# EAGLE design AmplifierHardwareSupply (EAGLE 9.5.2)
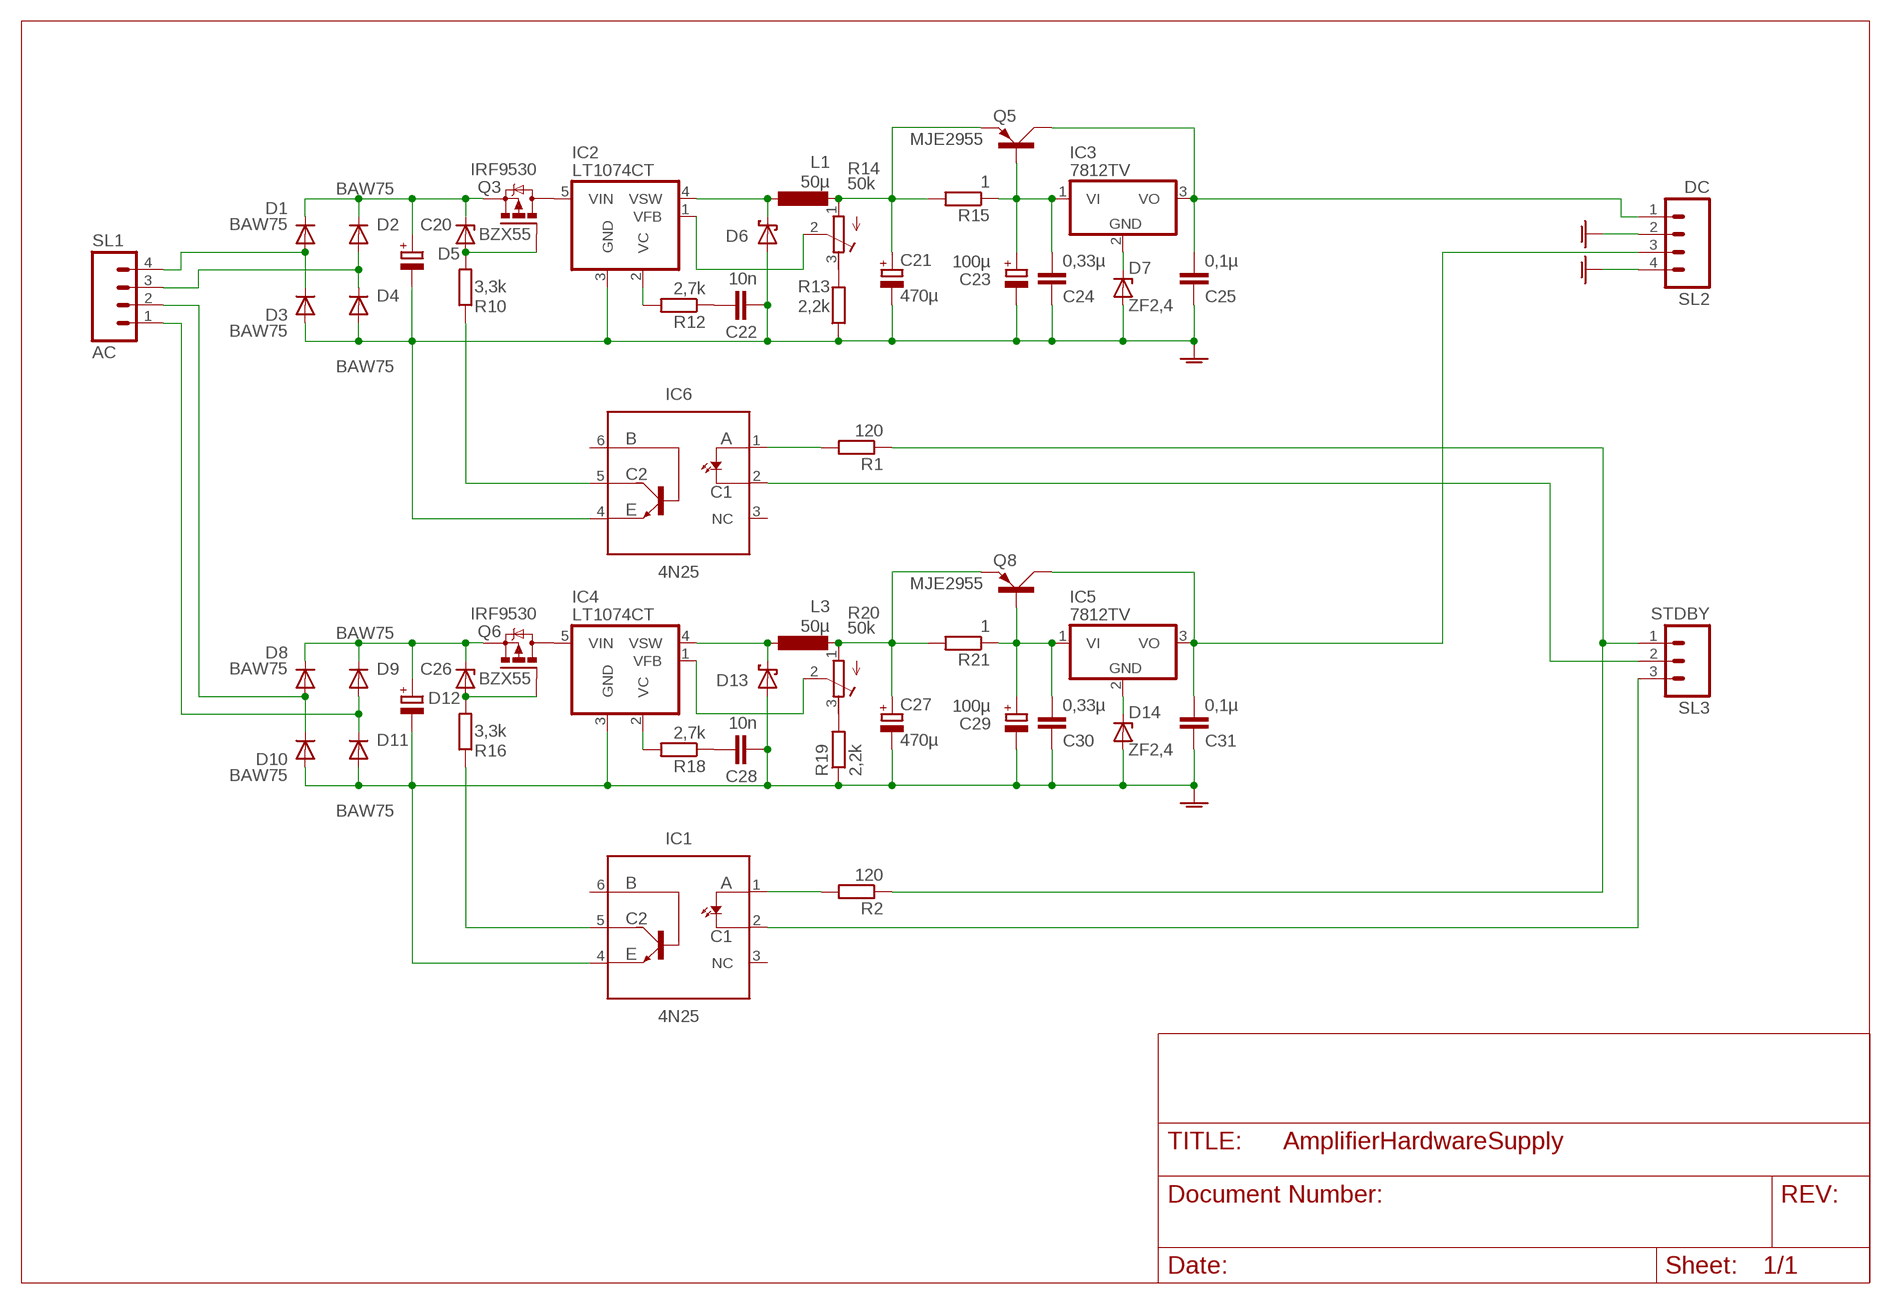
[diagram p0: schematic, sheet 1]

## Parts
C20  CPOL-EUE5-10.5  [E5-10,5]
C21  470µ  CPOL-EUE5-10.5  [E5-10,5]
C22  10n  C-EU025-024X044  [C025-024X044]
C23  100µ  CPOL-EUE5-10.5  [E5-10,5]
C24  0,33µ  C-EU025-024X044  [C025-024X044]
C25  0,1µ  C-EU025-024X044  [C025-024X044]
C26  CPOL-EUE5-10.5  [E5-10,5]
C27  470µ  CPOL-EUE5-10.5  [E5-10,5]
C28  10n  C-EU025-024X044  [C025-024X044]
C29  100µ  CPOL-EUE5-10.5  [E5-10,5]
C30  0,33µ  C-EU025-024X044  [C025-024X044]
C31  0,1µ  C-EU025-024X044  [C025-024X044]
D1  BAW75  [DO35-10]
D2  BAW75  [DO35-10]
D3  BAW75  [DO35-10]
D4  BAW75  [DO35-10]
D5  BZX55  [DO35Z10]
D6  SCHOTTKY-DIODEDO35-7  [DO35-7]
D7  ZF2,4  BZV10  [DO34Z7]
D8  BAW75  [DO35-10]
D9  BAW75  [DO35-10]
D10  BAW75  [DO35-10]
D11  BAW75  [DO35-10]
D12  BZX55  [DO35Z10]
D13  SCHOTTKY-DIODEDO35-7  [DO35-7]
D14  ZF2,4  BZV10  [DO34Z7]
IC1  4N25  [DIP762W60P254L712H480Q6B]
IC2  LT1074CT  [TO220-5]
IC3  7812TV  [TO220V]
IC4  LT1074CT  [TO220-5]
IC5  7812TV  [TO220V]
IC6  4N25  [DIP762W60P254L712H480Q6B]
L1  50µ  L-EUTJ3-U1  [TJ3-U1]
L3  50µ  L-EUTJ3-U1  [TJ3-U1]
Q3  IRF9530  [TO220BV]
Q5  MJE2955  [TO220AV]
Q6  IRF9530  [TO220BV]
Q8  MJE2955  [TO220AV]
R1  120  R-EU_0207/2V  [0207/2V]
R2  120  R-EU_0207/2V  [0207/2V]
R10  3,3k  R-EU_0207/2V  [0207/2V]
R12  2,7k  R-EU_0207/2V  [0207/2V]
R13  2,2k  R-EU_0207/2V  [0207/2V]
R14  50k  R-TRIMM64W  [RTRIM64W]
R15  1  R-EU_0207/2V  [0207/2V]
R16  3,3k  R-EU_0207/2V  [0207/2V]
R18  2,7k  R-EU_0207/2V  [0207/2V]
R19  2,2k  R-EU_0207/2V  [0207/2V]
R20  50k  R-TRIMM64W  [RTRIM64W]
R21  1  R-EU_0207/2V  [0207/2V]
SL1  AC  M04  [04P]
SL2  DC  M04  [04P]
SL3  STDBY  M03  [03P]

## Nets
+UB2: C31.2 IC5.3(VO) Q8.C SL2.3
AGND: C20.- C21.- C22.2 C23.- C24.1 C25.1 C26.- C27.- C28.2 C29.- C30.1 C31.1 D3.A D4.A D6.A D7.A D10.A D11.A D13.A D14.A IC1.4(E) IC2.3(GND) IC4.3(GND) IC6.4(E) R13.1 R19.1 SL2.2 SL2.4
N$1: C25.2 IC3.3(VO) Q5.C SL2.1
N$2: R1.1 R2.1 SL3.1
N$3: IC6.1(A) R1.2
N$4: IC1.1(A) R2.2
N$5: IC6.2(C1) SL3.2
N$6: IC1.2(C1) SL3.3
N$24: IC2.2(VC) R12.2
N$25: R13.2 R14.3(A)
N$26: D1.A D3.C SL1.4
N$28: IC4.2(VC) R18.2
N$30: IC2.5(VIN) Q3.D
N$31: D5.A Q3.G R10.2
N$32: IC6.5(C2) R10.1
N$33: C21.+ L1.2 Q5.E R14.1(E) R15.2
N$34: C22.1 R12.1
N$35: D6.C IC2.4(VSW) L1.1
N$36: IC2.1(VFB) R14.2(S)
N$38: D7.C IC3.2(GND)
N$39: R19.2 R20.3(A)
N$40: C23.+ C24.2 IC3.1(VI) Q5.B R15.1
N$41: D8.A D10.C SL1.2
N$43: D9.A D11.C SL1.1
N$44: C26.+ D8.C D9.C D12.C Q6.S
N$45: D12.A Q6.G R16.2
N$46: IC1.5(C2) R16.1
N$47: C28.1 R18.1
N$48: D13.C IC4.4(VSW) L3.1
N$49: IC4.5(VIN) Q6.D
N$50: C27.+ L3.2 Q8.E R20.1(E) R21.2
N$51: IC4.1(VFB) R20.2(S)
N$53: C29.+ C30.2 IC5.1(VI) Q8.B R21.1
N$55: D14.C IC5.2(GND)
N$58: C20.+ D1.C D2.C D5.C Q3.S
N$71: D2.A D4.C SL1.3
Unconnected: IC1.3(NC) IC1.6(B) IC6.3(NC) IC6.6(B)

## Library data of the parts
C20 C21 C23 C26 C27 C29 = rcl:CPOL-EU: POLARIZED CAPACITOR, European symbol
C22 C24 C25 C28 C30 C31 = rcl:C-EU: CAPACITOR, European symbol
D1-D4 D8-D11 = diode:BAW75: DIODE silicon-epitaxial planar diode
D5 D12 = diode:BZX55: Z DIODE
D6 D13 = diode:SCHOTTKY-DIODE: Schottky Diode
D7 D14 = diode:BZV10: Z DIODE
IC1 IC6 = Opto-Electronic:4N: Optocoupler, Phototransistor Output, with Base Connection Datasheet <https://www.vishay.com/docs/83725/4n25.pdf>; CATEGORY: Opto-Electronic; DESCRIPTION: Optoisolator Transistor with Base Output 5000Vrms Channel 6-DIP; MANUFACTURER: Vishay; MPN: 4N25; OPERATING_TEMP: - 55°C to + 100 °C; PART_STATUS: Active; ROHS_COMPLIANT: COMPLIANT; SERIES: 4N2x; SUB-CATEGORY: Optocoupler; THERMALLOSS: 0.150 W
IC2 IC4 = linear-technology-3:LT1074*: Step-Down Switching Regulator
IC3 IC5 = linear:78*: Positive VOLTAGE REGULATOR Source: http://cache.national.com/ds/LM/LM78L05.pdf http://www.fairchildsemi.com/ds/LM/LM7805.pdf
L1 L3 = rcl:L-EU: INDUCTOR, European symbol
Q3 Q6 = transistor-power:IRF9530: P-CHANNEL HEXFET POWER-MOS-FET Source: http://www.irf.com/product-info/datasheets/data/irf9530.pdf
Q5 Q8 = transistor-power:MJE2955: PNP TRANSISTOR
R1 R2 R10 R12 R13 R15 R16 R18 R19 R21 = rcl:R-EU_: RESISTOR, European symbol
R14 R20 = rcl:R-TRIMM: Trimm resistor
SL1 SL2 = con-amp-quick:M04: AMP QUICK CONNECTOR
SL3 = con-amp-quick:M03: AMP QUICK CONNECTOR

## Board
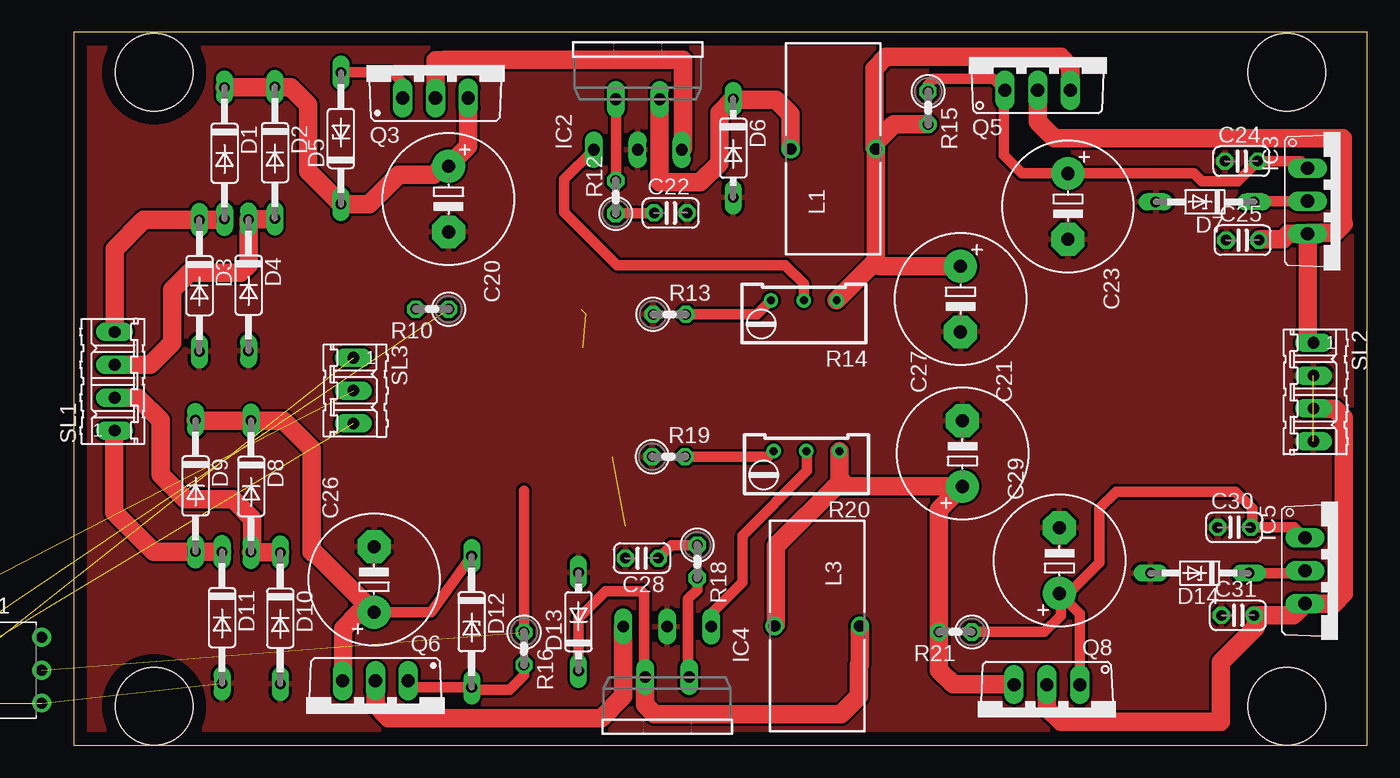
[diagram p1: board, top side]
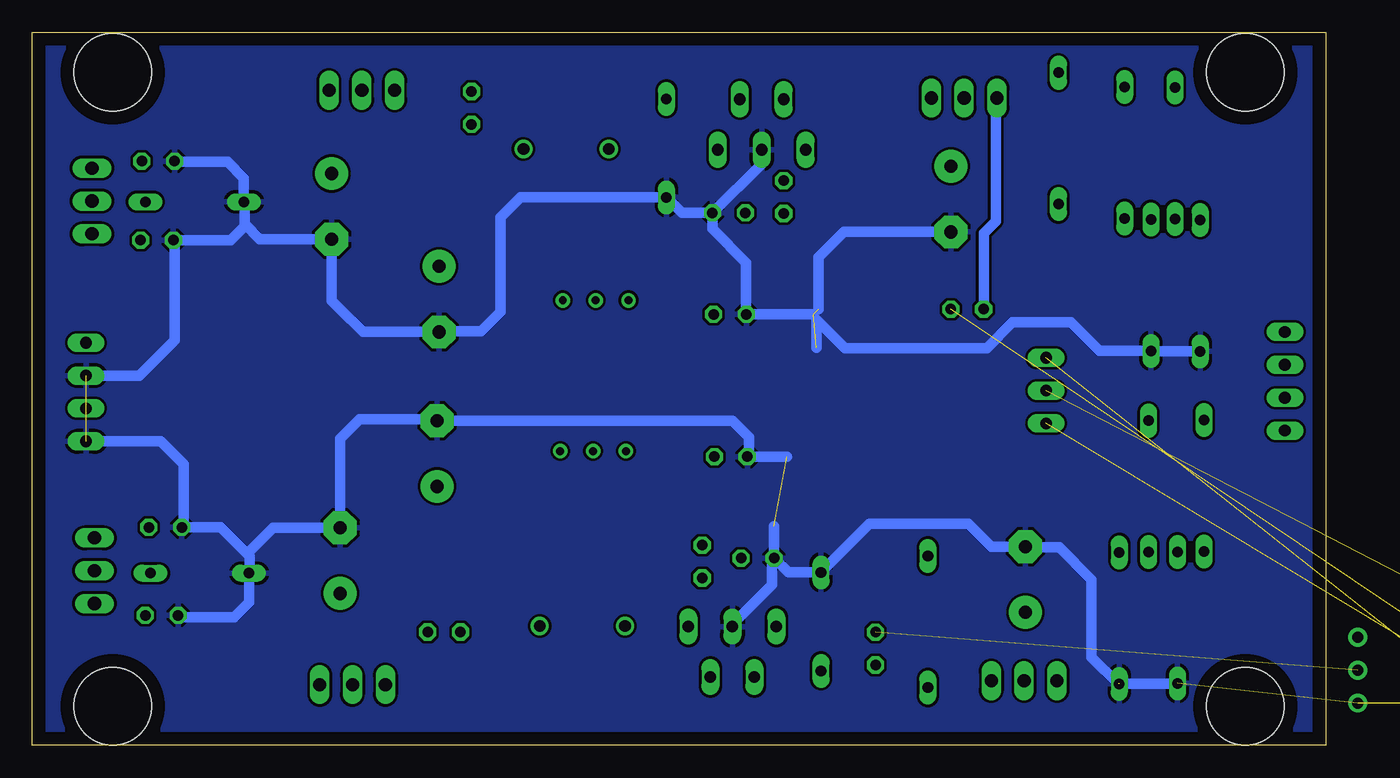
[diagram p2: board, bottom side, seen from below]

Size 100 x 55.1 mm. Coordinates in mm from the lower left corner, seen from the top.
Outline: 0,0 100,0 100,55.1 0,55.1 0,0
Copper layers (1*16): Top 0.035mm / dielectric 1.5mm / Bottom 0.035mm
Design rules "default": minimum track width 10mil, minimum drill 24mil, track to track 8mil, track to pad 8mil, pad to pad 8mil, via to via 8mil, smd to smd 8mil, copper to edge 40mil, drill to drill 8mil, minimum pad ring 10mil, minimum via ring 8mil, stop-mask expansion 4mil, vias tented up to drill 0mil, thermal gap 10mil
Holes 6 mm at 6.2,52 93.8,52 6.2,3 93.8,3

### Footprints (pad centres in the part's own frame; a part is rotated, then mirrored left to right if it is on the bottom)
E5-10,5 = drill 1.016 pad 2.54: + -2.54,0 | drill 1.016 pad 2.54 octagon: - 2.54,0
C025-024X044 = drill 0.813 octagon: 1 -1.27,0; 2 1.27,0
DO35-10 = drill 0.813 long: A 5.08,0; C -5.08,0
DO35Z10 = drill 0.813 long: A 5.08,0; C -5.08,0
DO35-7 = drill 0.813 long: A 3.81,0; C -3.81,0
DO34Z7 = drill 0.813 long: A 3.81,0; C -3.81,0
DIP762W60P254L712H480Q6B = drill 0.85 pad 1.45: 1 -3.81,2.54; 2 -3.81,0; 3 -3.81,-2.54; 4 3.81,-2.54; 5 3.81,0; 6 3.81,2.54
TO220-5 = drill 0.9 long: 1 -3.4,-8.4; 2 -1.7,-4.5; 3 0,-8.4; 4 1.7,-4.5; 5 3.4,-8.4
TO220V = drill 1.016 long: 1 -2.54,-2.54; 2 0,-2.54; 3 2.54,-2.54
TJ3-U1 = drill 0.9: 1 -3.3,0; 2 3.3,0
TO220BV = drill 1.016 long: D 0,-2.54; G -2.54,-2.54; S 2.54,-2.54
TO220AV = drill 1.016 long: B -2.54,-2.54; C 0,-2.54; E 2.54,-2.54
0207/2V = drill 0.813 octagon: 1 -1.27,0; 2 1.27,0
RTRIM64W = drill 0.61: 1 1.27,-2.54; 2 1.27,0; 3 1.27,2.54
04P = drill 0.914 long: 1 -3.81,0; 2 -1.27,0; 3 1.27,0; 4 3.81,0
03P = drill 0.914 long: 1 -2.54,0; 2 0,0; 3 2.54,0

### Placement (x,y rotation side)
C20  28.96,42.21 270 top
C21  68.56,34.48 270 top
C22  46.14,41.14 0 top
C23  76.86,41.65 270 top
C24  90.27,45.14 0 top
C25  90.36,39.04 0 top
C26  23.21,12.81 90 top
C27  68.71,22.54 90 top
C28  43.92,14.46 180 top
C29  76.21,14.27 90 top
C30  89.72,16.84 0 top
C31  90,10.04 0 top
D1  11.64,45.76 270 top
D2  15.54,45.8 270 top
D3  9.7,35.52 270 top
D4  13.5,35.56 270 top
D5  20.65,46.9 90 top
D6  50.98,46.15 270 top
D7  87.45,42 180 top
D8  13.7,20 270 top
D9  9.4,20.04 270 top
D10  15.95,9.82 270 top
D11  11.45,9.86 270 top
D12  30.75,9.54 270 top
D13  39.02,9.55 90 top
D14  87.05,13.3 180 top
IC1  -6.3,5.8 0 top
IC2  43.6,54.43 0 top
IC3  97.93,42.06 270 top
IC4  45.87,0.77 180 top
IC5  97.73,13.49 270 top
IC6  -16.3,5.8 0 top  (outside the outline)
L1  58.72,46.09 0 top
L3  57.47,9.21 180 top
Q3  27.95,52.56 0 top
Q5  74.52,53.16 0 top
Q6  23.31,2.44 180 top
Q8  75.24,2.14 180 top
R1  -18.9,-3.1 0 top  (outside the outline)
R2  -18.9,-8.7 0 top  (outside the outline)
R10  27.71,33.7 180 top
R12  41.9,42.37 90 top
R13  46.05,33.3 0 top
R14  56.44,33.12 90 top
R15  66.05,49.26 270 top
R16  34.8,7.47 270 top
R18  48.2,14.19 270 top
R19  45.99,22.3 0 top
R20  56.64,21.46 90 top
R21  68.16,8.75 180 top
SL1  3.15,28.13 90 top
SL2  95.85,27.3 270 top
SL3  21.61,27.41 270 top

### Tracks (layer width: path | path; a pad name or v marks a point on that pad's centre or on a via)
+UB2
  Top 0.406: 91.4,9.91 C31.2 | 95.88,26 SL2.3
  Top 1.422: Q8.C 75.24,2.86 76.3,1.8 88.7,1.8 88.7,6.4 91.4,9.1 91.4,9.91 | C31.2 94.28,10.04 IC5.3 97.45,10.95 98.2,11.7 98.2,25.3 97.5,26 95.88,26
AGND  (7 unrouted)
  Bottom 0.406: D4.A 13.46,30.44 | 23.16,15.3 C26.- | R13.1 44.8,33.32 | 45.87,9.33 IC4.3 | C28.2 42.8,14.31 | 68.5,32 C21.- | 76.25,33.75 76.4,33.9 | C27.- 68.2,25.08 68.32,25.2 | R19.1 44.6,22.42 | 88.96,45.1 C24.1 | 83.6,40.3 83.6,40.1 | 83.6,41.96 D7.A | C25.1 89,38.95 | 83.2,15 83.2,14.6 | 83.2,13.34 D14.A | 88.59,9.9 C31.1 | C30.1 88.3,16.99
  Bottom 0.813: 13.46,30.44 D3.A | 16.04,4.74 18.1,6.8 18.1,12.8 20.6,15.3 23.16,15.3 | 39.2,33.69 39.2,37.7 37.23,39.67 C20.- | 39.36,30.71 39.36,32.9 37.16,30.7 26.2,30.7 24.2,32.7 19.7,32.7 17.48,30.48 D4.A | 39.59,33.3 R13.1 | 41.66,22.3 R19.1 | C22.2 47.41,39.91 44.8,37.3 44.8,33.32 | C26.- 25.85,15.35 27.6,17.1 35.28,17.1 D13.A 41.55,13.36 C28.2 42.65,16.91 | 45.87,9.33 42.8,12.4 42.8,14.31 | IC2.3 43.6,44.95 C22.2 | C22.2 49.78,41.14 D6.A 62.26,42.34 63.8,40.8 63.8,33.5 65.3,32 68.5,32 | C21.- 74.44,31.94 76.25,33.75 76.86,34.36 C23.- 82.41,39.11 83.6,40.3 83.6,41.96 | 68.2,25.08 45.88,25.08 44.6,23.8 44.6,22.42 | 68.32,25.2 74.7,25.2 76.21,23.69 C29.- 81.39,16.81 83.2,15 | D7.A 83.64,43.84 84.9,45.1 88.96,45.1 | C25.1 84.66,39.04 83.6,40.1 | SL2.2 91.73,28.57 89,31.3 89,38.95 | 83.2,13.34 83.2,14.6 85.44,16.84 C30.1 | D14.A 83.24,11.06 84.4,9.9 88.59,9.9 | SL2.4 90.09,23.49 88.3,21.7 88.3,16.99 | D10.A 11.49,4.74 D11.A
  pour Bottom: 99.8,0.3 0.4,0.3 0.4,54.8 99.8,54.8
  pour Top: 0.3,0.5 0.3,54.7 99.7,54.7 99.7,0.5
N$1
  Top 0.406: 91.69,39.1 C25.2
  Top 1.422: Q5.C 74.52,48.18 75.8,46.9 98.1,46.9 98.1,40.4 98.2,40.3 97.5,39.6 95.47,39.6 IC3.3 | IC3.3 93.92,39.52 93.5,39.1 91.69,39.1 | IC3.3 95.39,31.57 SL2.1
N$2  (2 unrouted)
N$3  (1 unrouted)
N$4  (1 unrouted)
N$5  (1 unrouted)
N$6  (1 unrouted)
N$24
  Top 0.813: R12.2 IC2.2
N$25
  Top 0.813: R13.2 52.81,33.3 R14.3
N$26
  Top 0.406: 11.56,40.6 D1.A
  Top 1.422: SL1.4 3.15,38.35 5.4,40.6 D3.C 11.56,40.6
N$28
  Top 0.406: IC4.2 47.5,5.34
  Top 0.813: R18.2 48.2,12 47.5,11.3 47.5,5.34
N$30
  Top 0.406: 47.1,46.13 IC2.5
  Top 1.422: Q3.D 27.95,52.95 28.7,53 47.1,53 47.1,46.13
N$31
  Top 0.406: 20.67,52 D5.A
  Top 0.813: Q3.G 25.41,51.19 24.6,52 20.67,52
  Bottom 0.406: 25.5,49.93 Q3.G
  Bottom 0.813: R10.2 26.44,39.56 25.5,40.5 25.5,49.93
N$32  (1 unrouted)
  Top 0.406: R10.1 29.15,33.53
N$33
  Top 0.406: 62.02,37.43 61.99,37.41 62.38,37.02
  Top 1.422: 62.02,37.43 L1.2 | R14.1 61.99,37.41 | 62.38,37.02 C21.+ | L1.2 62.02,46.62 63.4,48 R15.2 | Q5.E 77.06,52.44 76.3,53.2 62.8,53.2 61.9,52.3 61.9,46.21 L1.2
N$34
  Top 0.406: 44.83,41.1 C22.1
  Top 0.813: R12.1 44.83,41.1
N$35
  Top 0.406: D6.C 51.04,49.9
  Top 1.422: L1.1 55.42,48.78 54.3,49.9 51.04,49.9 | IC2.4 45.3,43.5 48.4,43.5 49.9,45 49.9,48.88 D6.C
N$36
  Top 0.813: R14.2 56.44,35.66 55,37.1 42,37.1 37.9,41.2 37.9,43.73 IC2.1
N$38
  Top 0.813: IC3.2 91.32,42.06 D7.C
N$39
  Top 0.813: R19.2 53.67,22.3 R20.3
N$40
  Top 0.406: 70.79,51.63 71.8,50.62 Q5.B 71.9,50.54 | 83.7,44.19 84.09,44.19 | C24.2 91.6,45.2
  Top 0.813: 71.9,50.54 71.9,45.6 73.31,44.19 C23.+ 83.7,44.19 83.71,44.2 86.6,44.2 87.2,43.6 90,43.6 C24.2 94.85,45.14 IC3.1 | R15.1 66.05,51.05 66.5,51.5 71.1,51.5 Q5.B
N$41
  Top 1.422: SL1.2 4.94,26.86 6.7,25.1 6.7,20.9 8.6,19 12.3,19 13.8,17.5 13.8,15.02 D8.A 15.93,14.92 D10.C
N$43
  Top 0.406: 3.1,24.27 SL1.1
  Top 1.422: 3.1,24.27 3.1,18 6.16,14.94 6.18,14.96 D9.A 9.42,14.94 D11.C
N$44
  Top 0.406: 18.58,14.9 18.4,14.9
  Top 0.813: C26.+ 27.6,10.27 D12.C
  Top 1.422: 18.4,14.9 18.4,22.9 16.22,25.08 D8.C 9.44,25.08 D9.C | 18.58,14.9 C26.+ 22.07,10.27 20.8,9 20.8,5.01 Q6.S
N$45
  Top 0.813: R16.2 34.8,5.4 33.7,4.3 30.91,4.3 D12.A 26.37,4.46 Q6.G
N$46  (1 unrouted)
  Top 0.813: R16.1 34.8,19.68
N$47
  Top 0.813: R18.1 46.19,15.46 C28.1
N$48
  Top 0.406: 44.1,5.34 IC4.4
  Top 0.813: D13.C 39.02,9.82 41.1,11.9 43.9,11.9 44.1,11.7 44.1,5.34
  Top 1.422: L3.1 60.77,6.27 60.7,6.2 60.7,3.8 59.3,2.4 44.9,2.4 44.17,3.13 IC4.4
N$49
  Top 1.422: IC4.5 42.47,3.77 40.8,2.1 24.3,2.1 23.31,3.09 Q6.D
N$50
  Top 0.406: 59.18,20.28 59.18,20.6
  Top 0.813: L3.2 54.3,9.34
  Top 1.422: R20.1 59.18,20.6 59.78,20 C27.+ 66.89,18.18 R21.2 66.89,5.81 68,4.7 72.68,4.7 Q8.E | 59.18,20.28 54.3,15.4 54.3,9.34
N$51
  Top 0.813: IC4.1 49.27,10.17 51.7,12.6 51.7,16.2 56.7,21.2 56.7,22.67 R20.2
N$53
  Top 0.406: 76.3,11.64 C29.+ | 91.1,16.95 C30.2
  Top 0.813: R21.1 75.05,8.75 76.3,10 76.3,11.64 | Q8.B 77.78,10.16 C29.+ 76.93,11.73 79.3,14.1 79.3,18.3 80.6,19.6 89.8,19.6 91.1,18.3 91.1,16.95 | C30.2 94.38,16.84 IC5.1
N$55
  Top 0.813: D14.C 95,13.3 IC5.2
N$58
  Top 0.406: 15.5,50.84 D2.C
  Top 1.422: D1.C 15.5,50.84 16.76,50.84 18.1,49.5 18.1,44.37 D5.C 22.82,41.82 25.1,44.1 27.8,44.1 28.45,44.75 C20.+ 30.49,46.28 Q3.S
N$71
  Top 0.406: 15.46,40.64 D2.A
  Top 1.422: SL1.3 5.9,29.4 7.6,31.1 7.6,35.2 8.9,36.5 12.9,36.5 13.5,37.1 D4.C 15.46,40.64